# EAGLE schematic npn_switch (EAGLE 6.4)
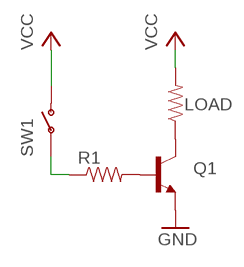
[diagram p0: schematic, sheet 1]

## Parts
LOAD  RESISTOR  [0603RES]
Q1  TRANSISTOR_NPN"  [SOT223]
R1  RESISTOR  [0603RES]
SW1  SWITCH-SPST-2RA  [R_SW_TH]

## Nets
GND: Q1.3(E)
N$1: LOAD.1 Q1.2(C)
N$2: Q1.1(B) R1.2
N$3: R1.1 SW1.P$4(P)
VCC: LOAD.2 SW1.P$3(O)

## Library data of the parts
LOAD R1 = Ava:RESISTOR
Q1 = SparkFun-DiscreteSemi:TRANSISTOR_NPN: Generic NPN BJT. MMBT2222 is the common NPN we use. Double check against datasheet- not all devices are the same!
SW1 = SparkFun-Electromechanical:SWITCH-SPST-2